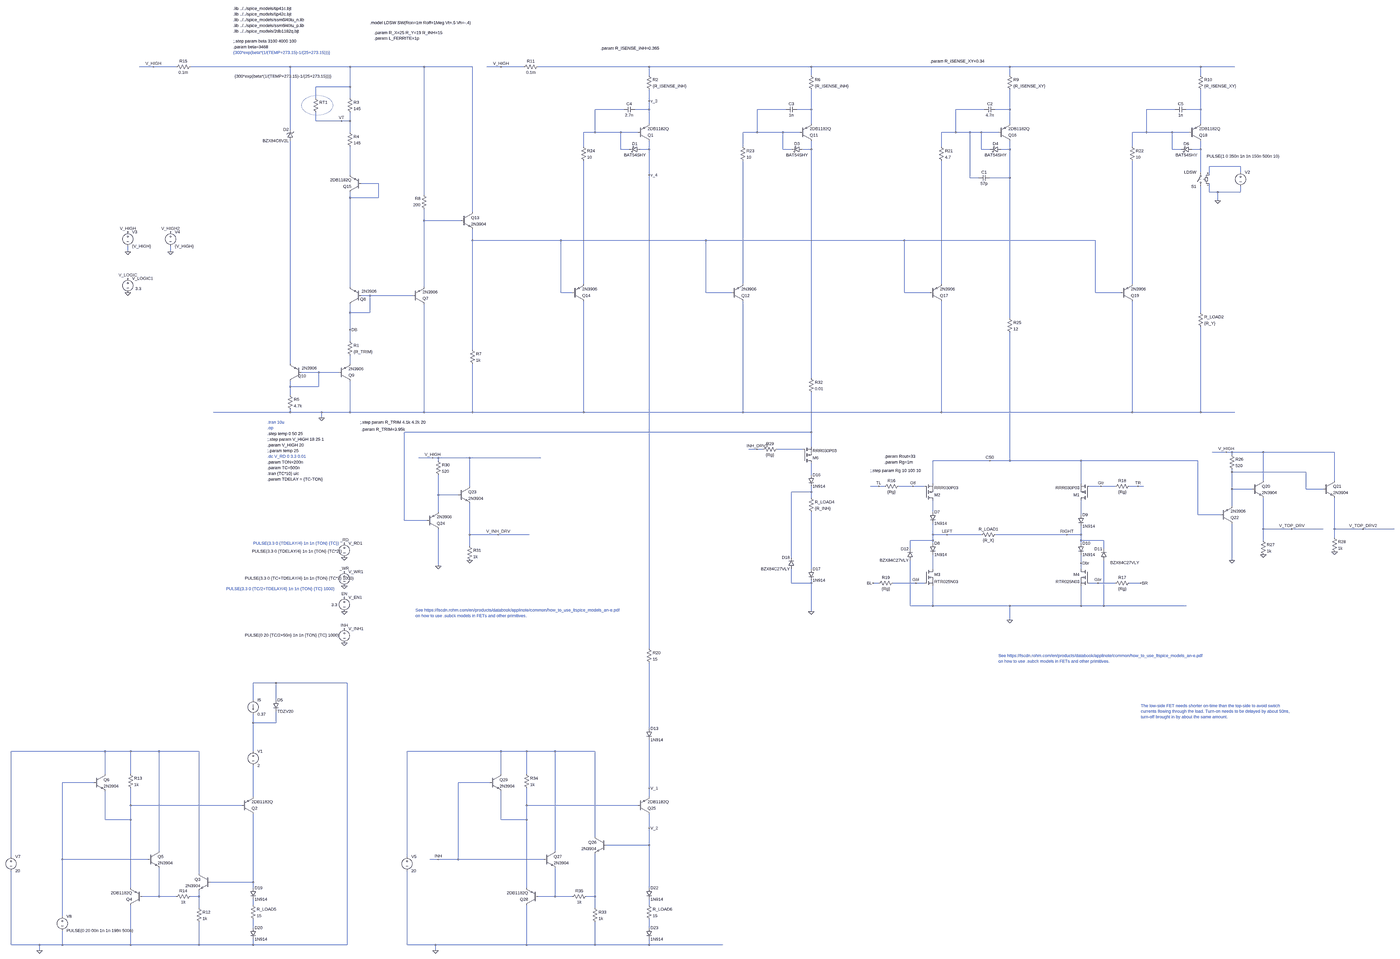
[diagram p0: schematic current_switch_test_bed_2.asc, whole sheet]
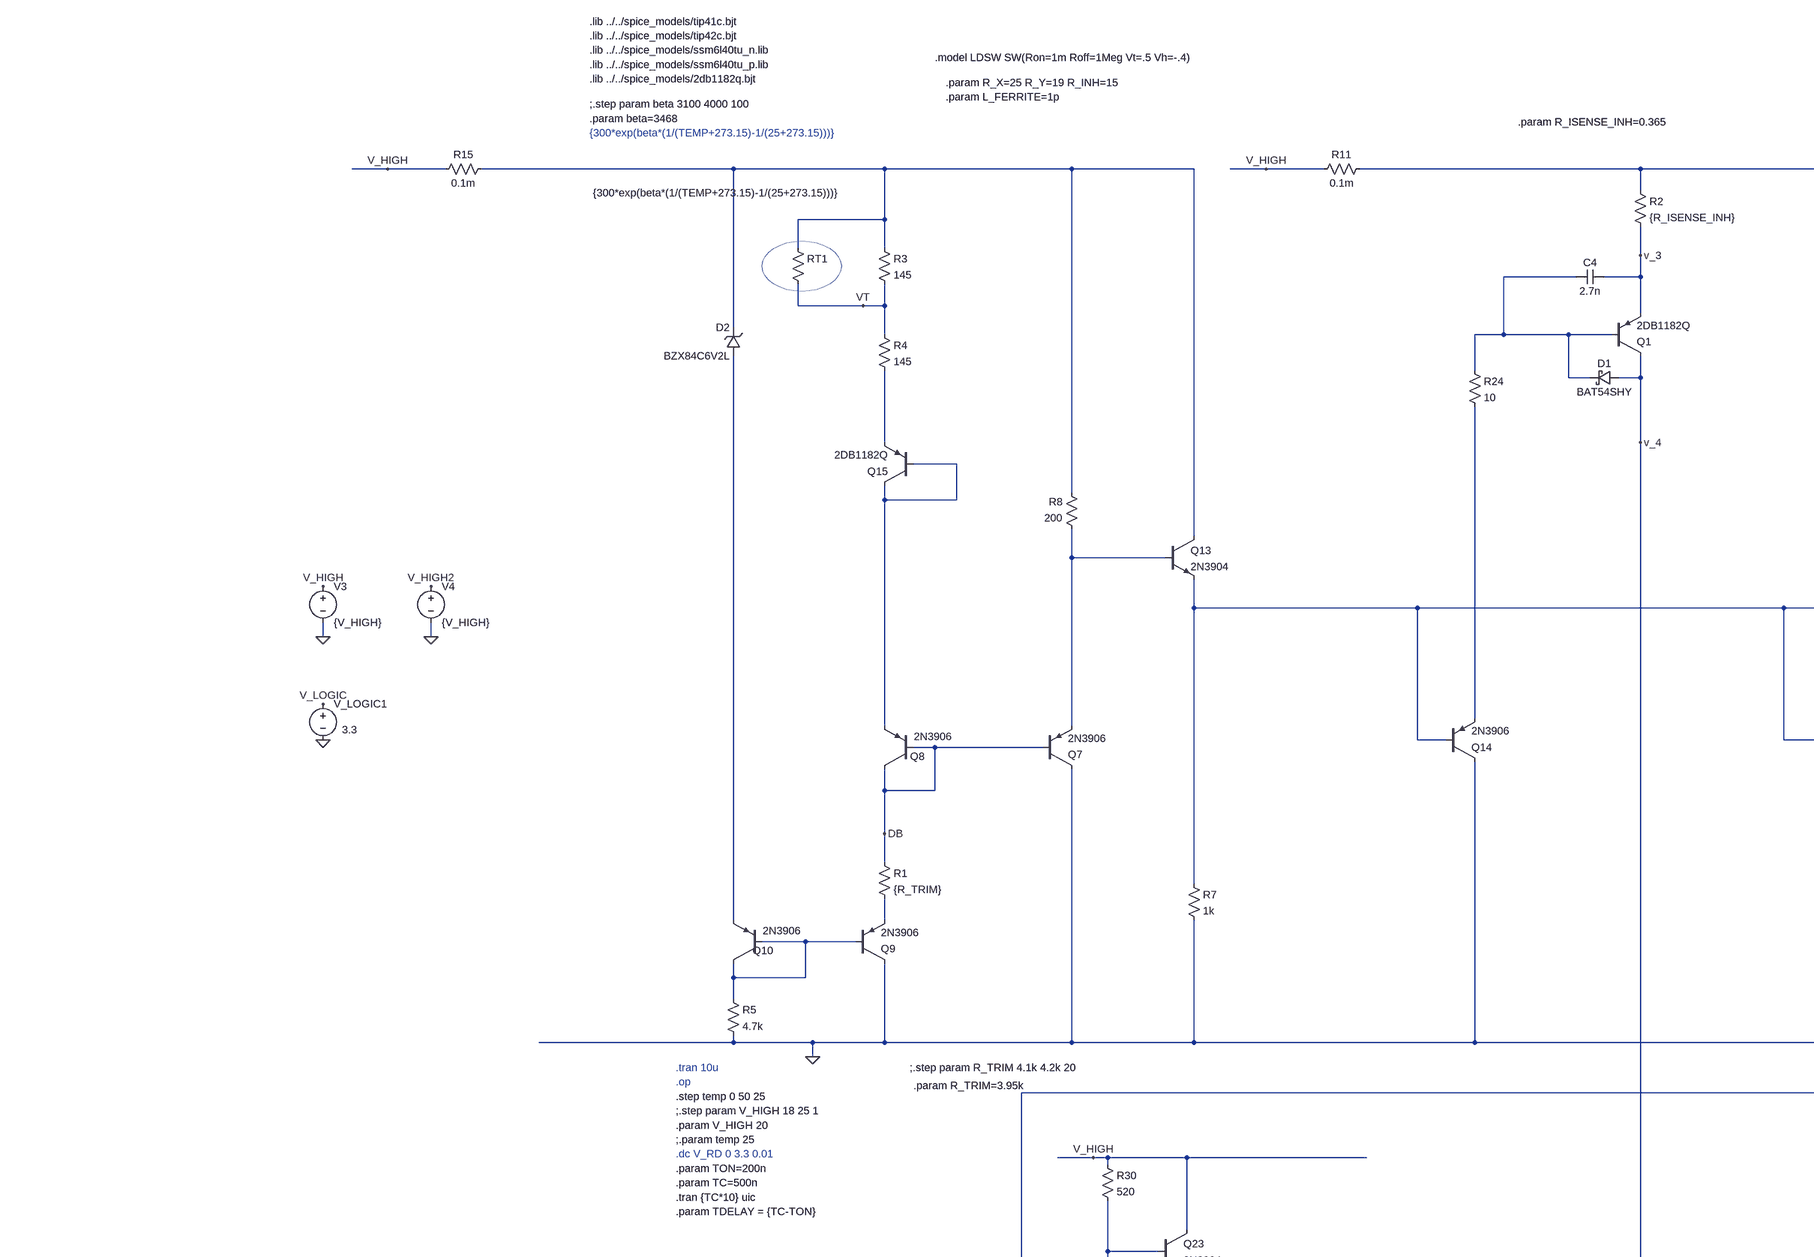
[diagram p1: schematic current_switch_test_bed_2.asc, part, row 1 of 2, column 1 of 2]
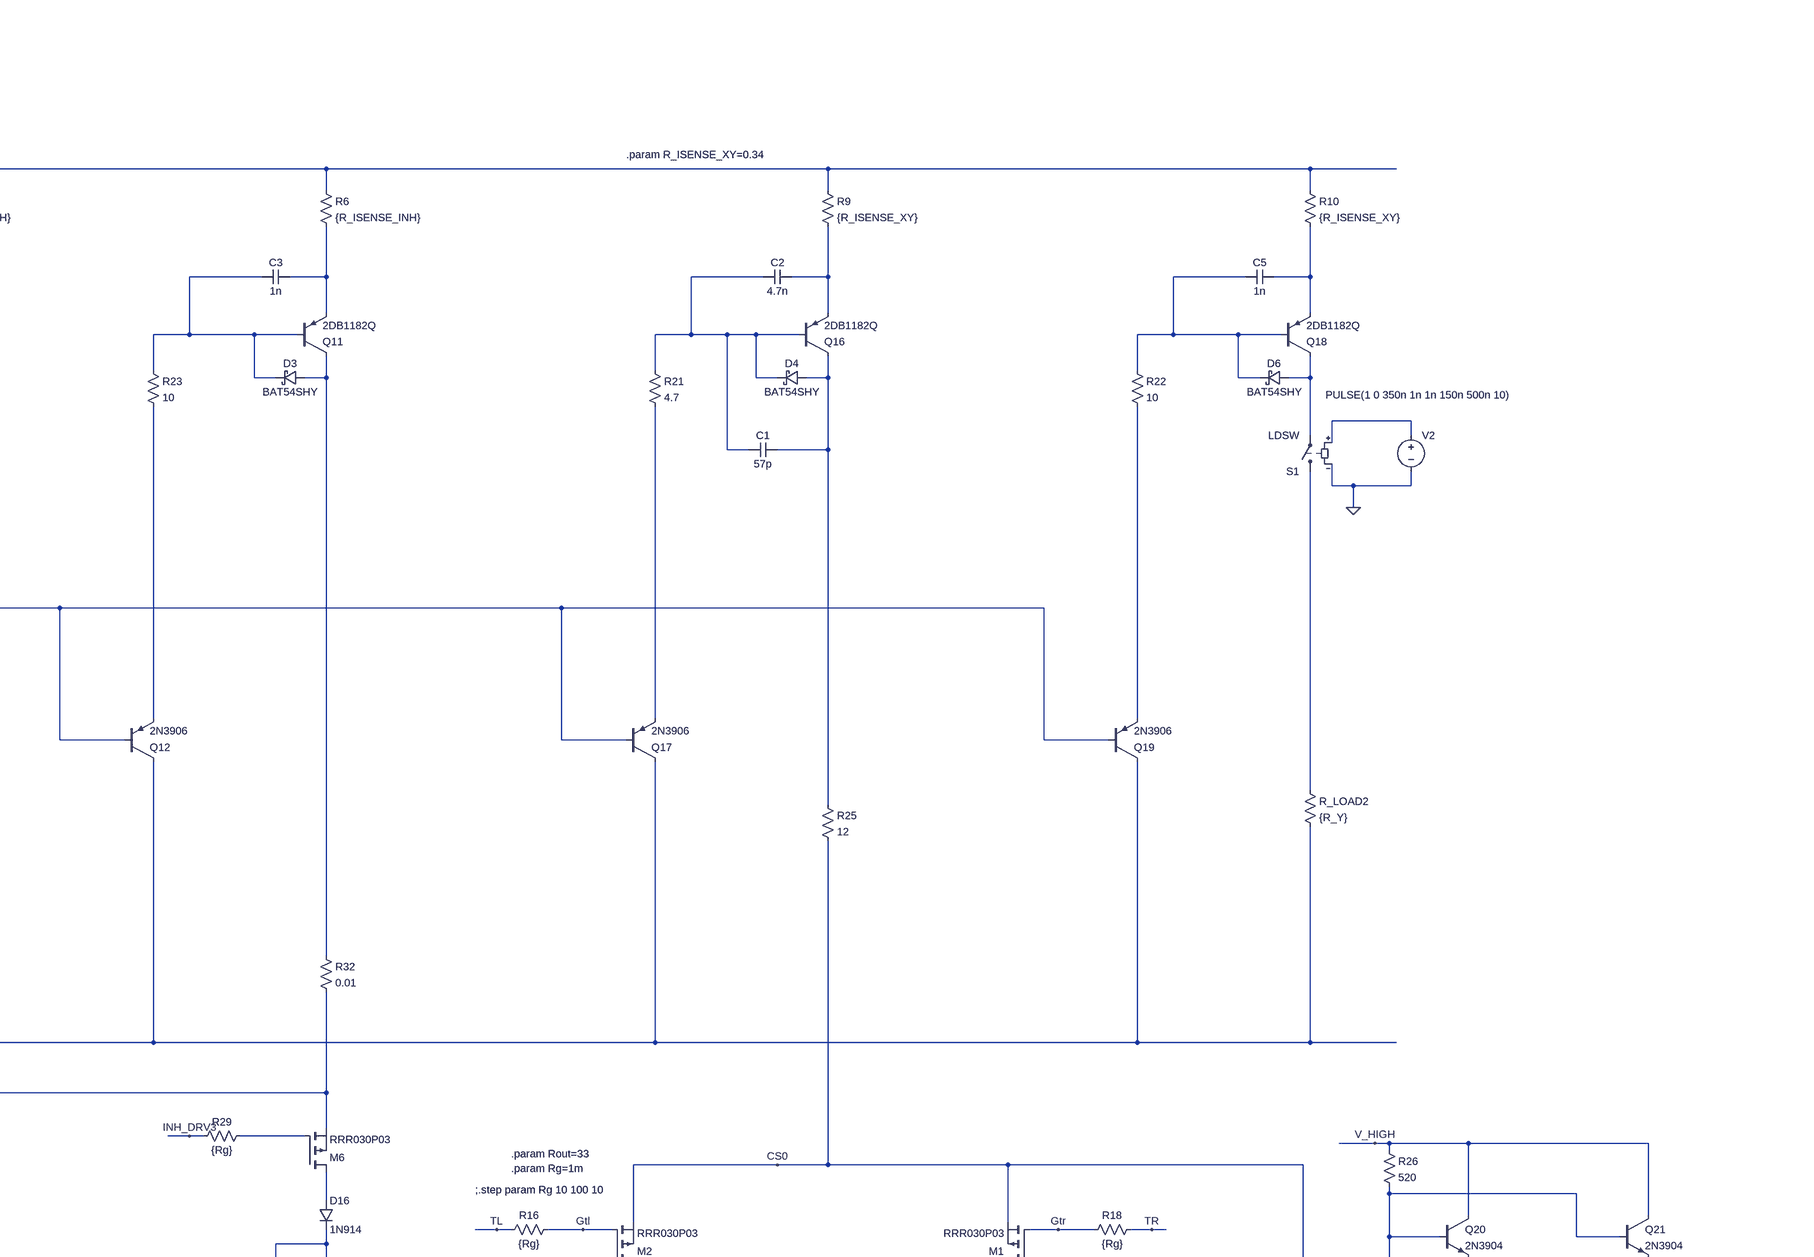
[diagram p2: schematic current_switch_test_bed_2.asc, part, row 1 of 2, column 2 of 2]
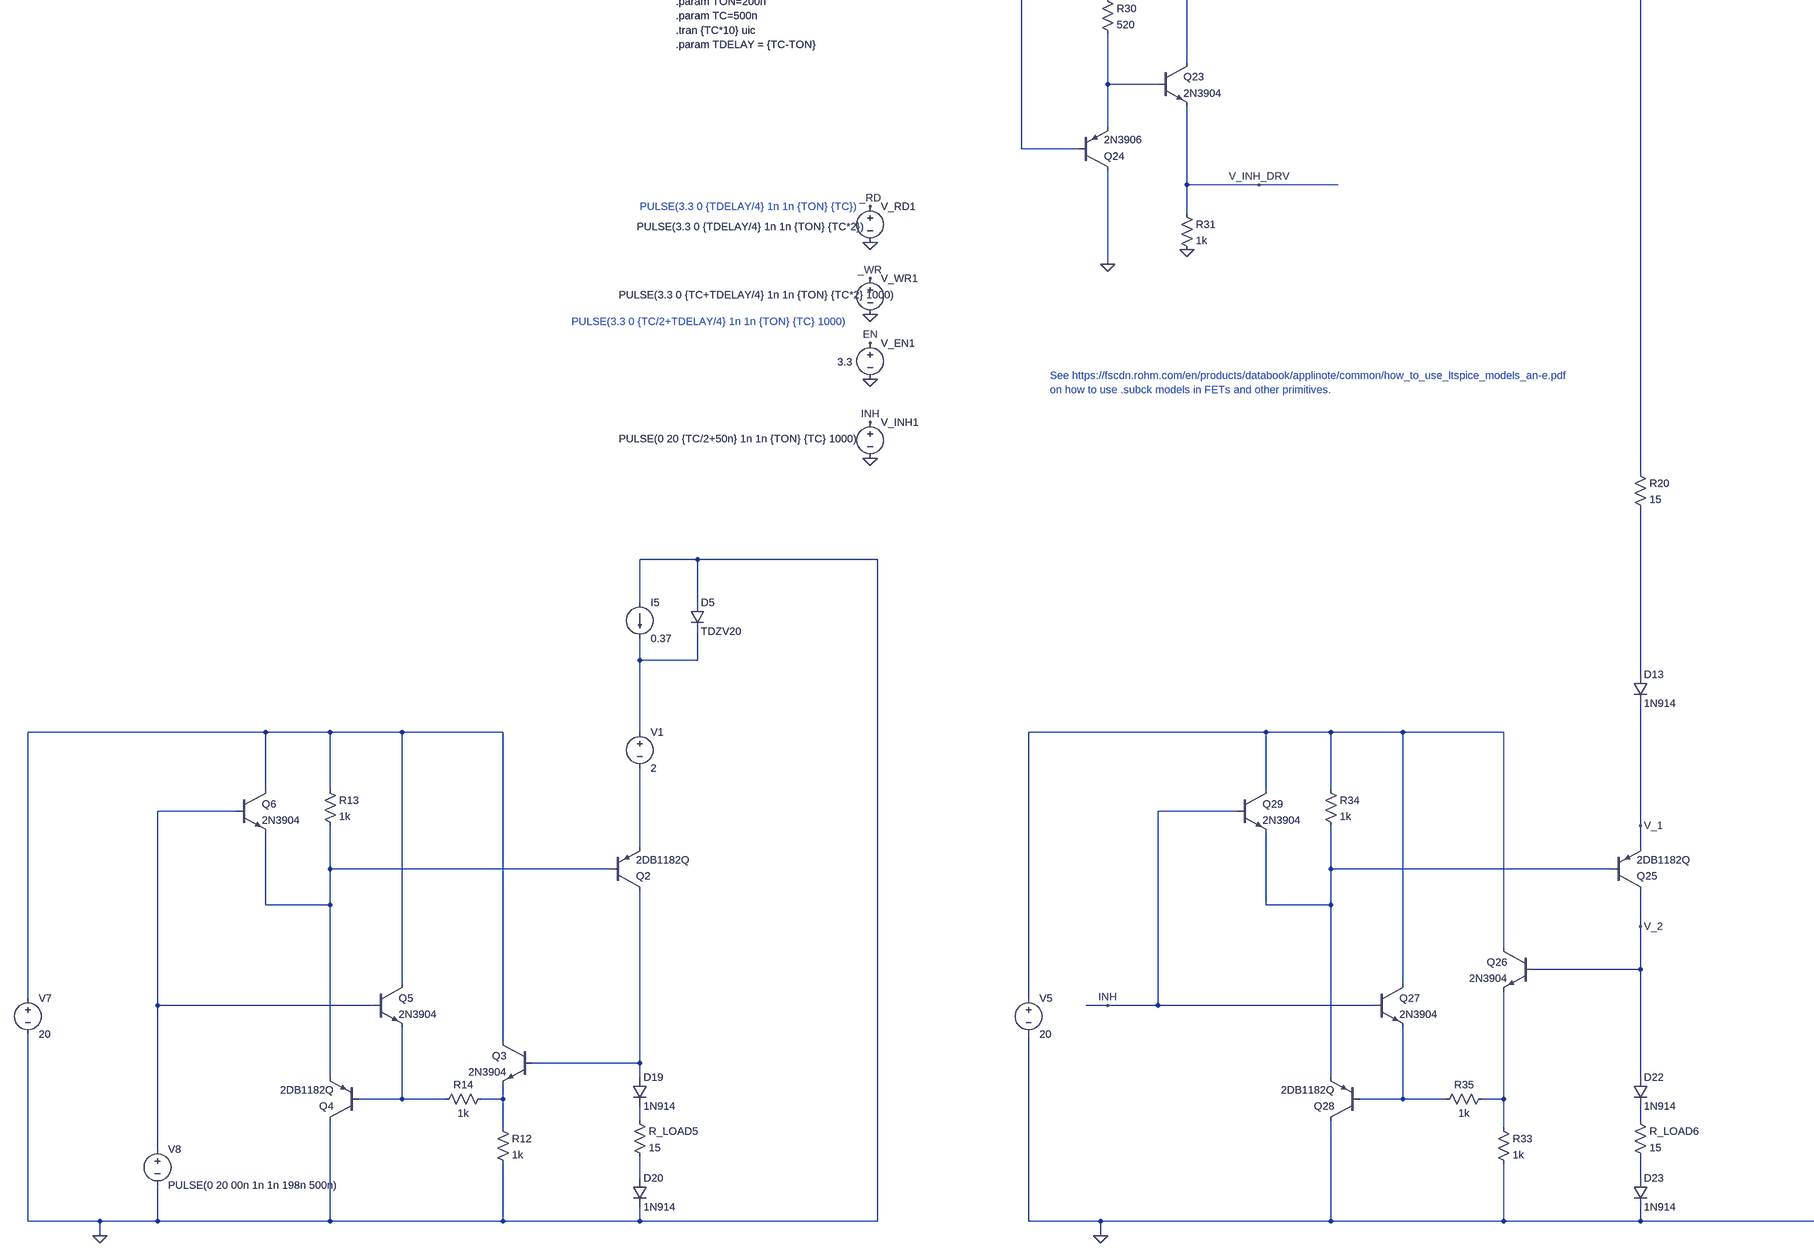
[diagram p3: schematic current_switch_test_bed_2.asc, part, row 2 of 2, column 1 of 2]
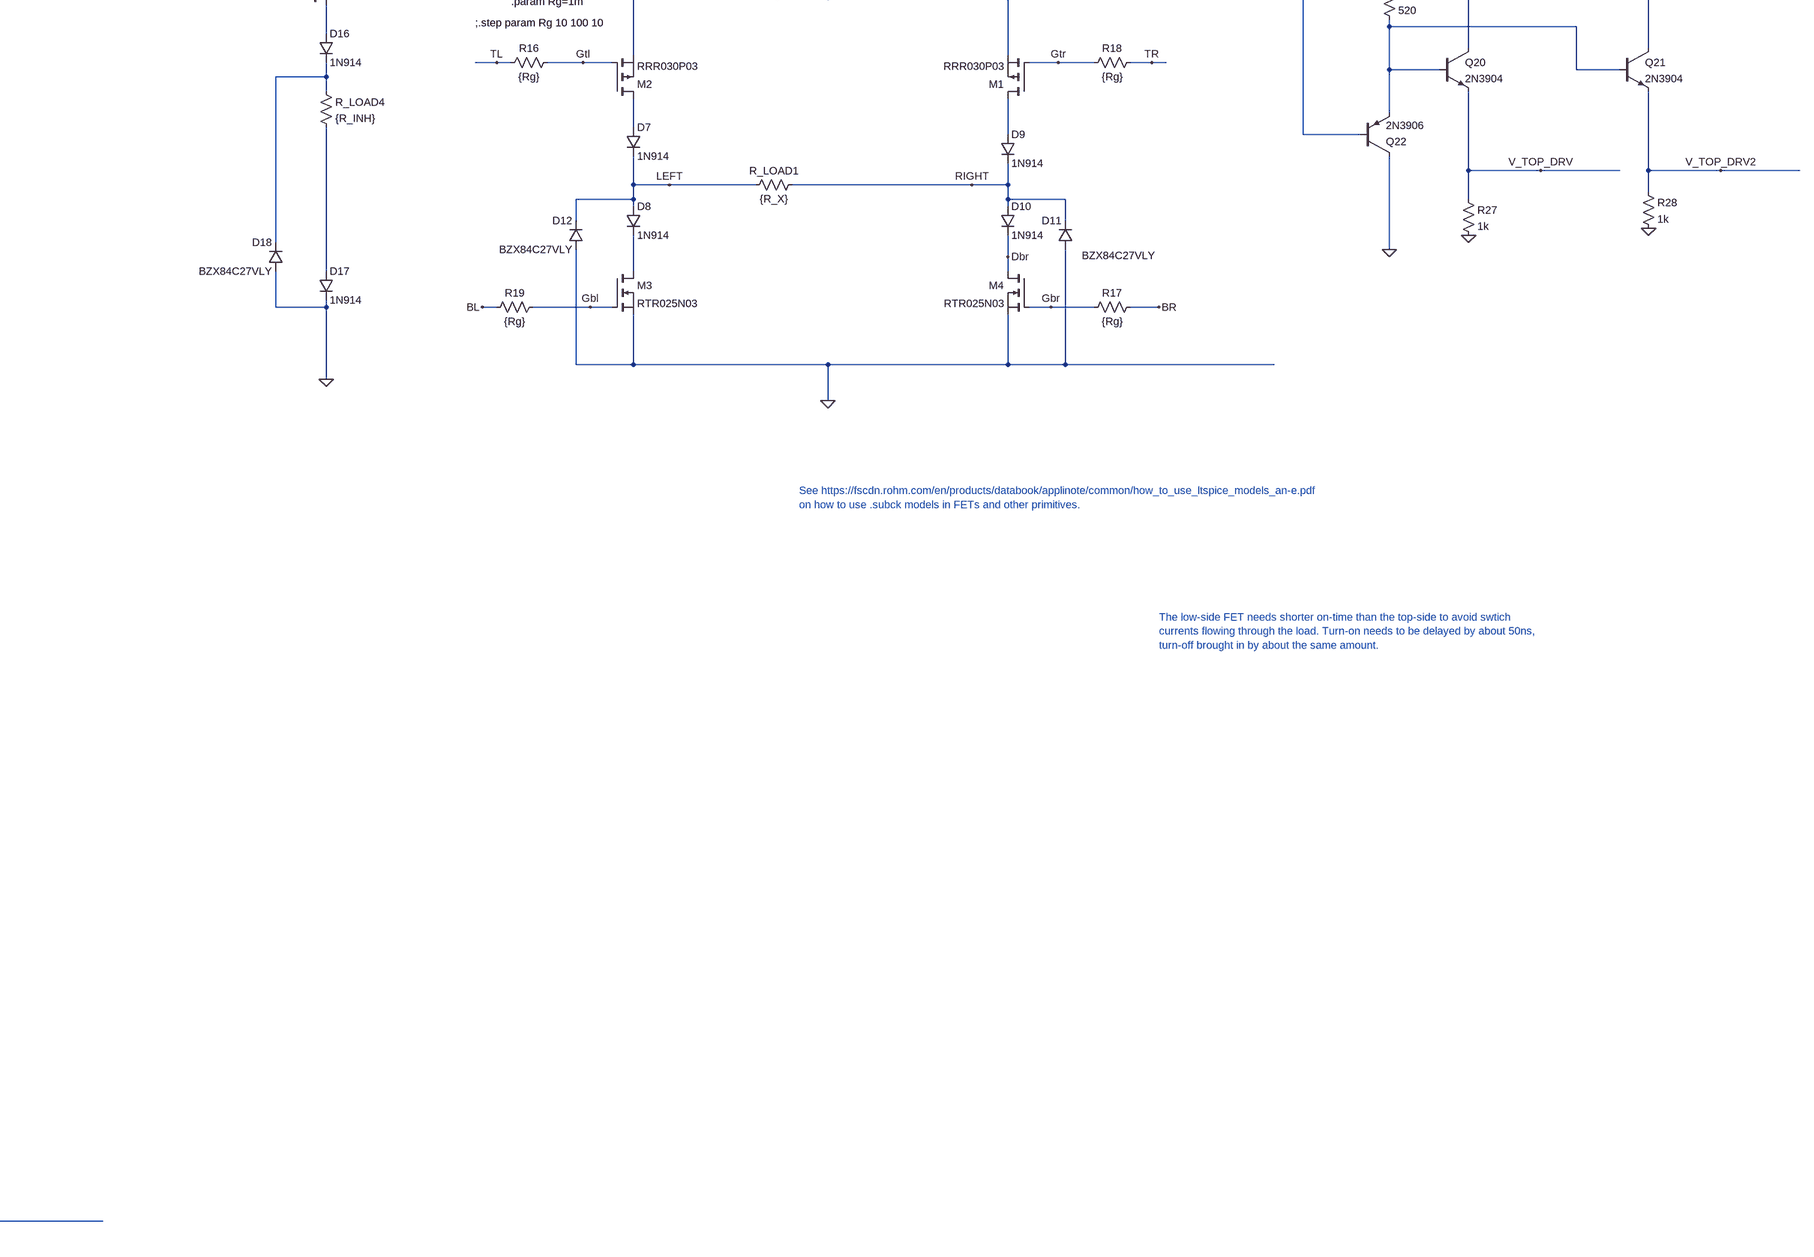
[diagram p4: schematic current_switch_test_bed_2.asc, part, row 2 of 2, column 2 of 2]
current_switch_test_bed_2.asc, the LTspice schematic file:
Version 4.1
SHEET 1 6468 2404
WIRE -624 -4320 -704 -4320
WIRE -496 -4320 -624 -4320
WIRE 144 -4320 -416 -4320
WIRE 480 -4320 144 -4320
WIRE 896 -4320 480 -4320
WIRE 1168 -4320 896 -4320
WIRE 1328 -4320 1248 -4320
WIRE 1456 -4320 1328 -4320
WIRE 2160 -4320 1536 -4320
WIRE 3184 -4320 2160 -4320
WIRE 4304 -4320 3184 -4320
WIRE 5376 -4320 4304 -4320
WIRE 5568 -4320 5376 -4320
WIRE 2160 -4272 2160 -4320
WIRE 3184 -4272 3184 -4320
WIRE 4304 -4272 4304 -4320
WIRE 5376 -4272 5376 -4320
WIRE 480 -4208 480 -4320
WIRE 480 -4208 288 -4208
WIRE 288 -4144 288 -4208
WIRE 480 -4144 480 -4208
WIRE 2160 -4128 2160 -4192
WIRE 2016 -4080 1856 -4080
WIRE 2160 -4080 2160 -4128
WIRE 2160 -4080 2080 -4080
WIRE 3040 -4080 2880 -4080
WIRE 3184 -4080 3184 -4192
WIRE 3184 -4080 3104 -4080
WIRE 4160 -4080 4000 -4080
WIRE 4304 -4080 4304 -4192
WIRE 4304 -4080 4224 -4080
WIRE 5232 -4080 5072 -4080
WIRE 5376 -4080 5376 -4192
WIRE 5376 -4080 5296 -4080
WIRE 288 -4016 288 -4064
WIRE 432 -4016 288 -4016
WIRE 480 -4016 480 -4064
WIRE 480 -4016 432 -4016
WIRE 2160 -4000 2160 -4080
WIRE 3184 -4000 3184 -4080
WIRE 4304 -4000 4304 -4080
WIRE 5376 -4000 5376 -4080
WIRE 144 -3968 144 -4320
WIRE 480 -3952 480 -4016
WIRE 1856 -3952 1856 -4080
WIRE 1856 -3952 1792 -3952
WIRE 2000 -3952 1856 -3952
WIRE 2096 -3952 2000 -3952
WIRE 2880 -3952 2880 -4080
WIRE 2880 -3952 2800 -3952
WIRE 3024 -3952 2880 -3952
WIRE 3120 -3952 3024 -3952
WIRE 4000 -3952 4000 -4080
WIRE 4000 -3952 3920 -3952
WIRE 4080 -3952 4000 -3952
WIRE 4144 -3952 4080 -3952
WIRE 4240 -3952 4144 -3952
WIRE 5072 -3952 5072 -4080
WIRE 5072 -3952 4992 -3952
WIRE 5216 -3952 5072 -3952
WIRE 5312 -3952 5216 -3952
WIRE 1792 -3872 1792 -3952
WIRE 2800 -3872 2800 -3952
WIRE 3920 -3872 3920 -3952
WIRE 4992 -3872 4992 -3952
WIRE 2000 -3856 2000 -3952
WIRE 2048 -3856 2000 -3856
WIRE 2160 -3856 2160 -3904
WIRE 2160 -3856 2112 -3856
WIRE 3024 -3856 3024 -3952
WIRE 3072 -3856 3024 -3856
WIRE 3184 -3856 3184 -3904
WIRE 3184 -3856 3136 -3856
WIRE 4144 -3856 4144 -3952
WIRE 4192 -3856 4144 -3856
WIRE 4304 -3856 4304 -3904
WIRE 4304 -3856 4256 -3856
WIRE 5216 -3856 5216 -3952
WIRE 5264 -3856 5216 -3856
WIRE 5376 -3856 5376 -3904
WIRE 5376 -3856 5328 -3856
WIRE 5600 -3760 5424 -3760
WIRE 5376 -3728 5376 -3856
WIRE 5600 -3728 5600 -3760
WIRE 480 -3712 480 -3872
WIRE 2160 -3712 2160 -3856
WIRE 5424 -3712 5424 -3760
WIRE 4080 -3696 4080 -3952
WIRE 4128 -3696 4080 -3696
WIRE 4304 -3696 4304 -3856
WIRE 4304 -3696 4192 -3696
WIRE 640 -3664 544 -3664
WIRE 5424 -3616 5424 -3664
WIRE 5472 -3616 5424 -3616
WIRE 5600 -3616 5600 -3648
WIRE 5600 -3616 5472 -3616
WIRE 896 -3600 896 -4320
WIRE 480 -3584 480 -3616
WIRE 640 -3584 640 -3664
WIRE 640 -3584 480 -3584
WIRE 5472 -3568 5472 -3616
WIRE 1168 -3504 1168 -4320
WIRE 896 -3456 896 -3520
WIRE 1104 -3456 896 -3456
WIRE 1168 -3344 1168 -3408
WIRE 1664 -3344 1168 -3344
WIRE 2592 -3344 1664 -3344
WIRE 3712 -3344 2592 -3344
WIRE 4784 -3344 3712 -3344
WIRE -768 -3280 -768 -3312
WIRE -528 -3280 -528 -3312
WIRE 1792 -3072 1792 -3792
WIRE 2800 -3072 2800 -3792
WIRE 3920 -3072 3920 -3792
WIRE 4992 -3072 4992 -3792
WIRE 480 -3056 480 -3584
WIRE 896 -3056 896 -3456
WIRE 1664 -3024 1664 -3344
WIRE 1728 -3024 1664 -3024
WIRE 2592 -3024 2592 -3344
WIRE 2736 -3024 2592 -3024
WIRE 3712 -3024 3712 -3344
WIRE 3856 -3024 3712 -3024
WIRE 4784 -3024 4784 -3344
WIRE 4928 -3024 4784 -3024
WIRE 592 -3008 544 -3008
WIRE 832 -3008 592 -3008
WIRE 480 -2912 480 -2960
WIRE 592 -2912 592 -3008
WIRE 592 -2912 480 -2912
WIRE 5376 -2912 5376 -3648
WIRE 4304 -2880 4304 -3696
WIRE 480 -2816 480 -2912
WIRE 480 -2752 480 -2816
WIRE 1168 -2704 1168 -3344
WIRE 144 -2624 144 -3904
WIRE 480 -2624 480 -2672
WIRE 304 -2576 208 -2576
WIRE 416 -2576 304 -2576
WIRE 3184 -2544 3184 -3856
WIRE 144 -2496 144 -2528
WIRE 304 -2496 304 -2576
WIRE 304 -2496 144 -2496
WIRE 144 -2448 144 -2496
WIRE 144 -2352 144 -2368
WIRE 144 -2352 -288 -2352
WIRE 320 -2352 144 -2352
WIRE 480 -2352 480 -2528
WIRE 480 -2352 320 -2352
WIRE 896 -2352 896 -2960
WIRE 896 -2352 480 -2352
WIRE 1168 -2352 1168 -2624
WIRE 1168 -2352 896 -2352
WIRE 1792 -2352 1792 -2976
WIRE 1792 -2352 1168 -2352
WIRE 2800 -2352 2800 -2976
WIRE 2800 -2352 1792 -2352
WIRE 3920 -2352 3920 -2976
WIRE 3920 -2352 2800 -2352
WIRE 4992 -2352 4992 -2976
WIRE 4992 -2352 3920 -2352
WIRE 5376 -2352 5376 -2832
WIRE 5376 -2352 4992 -2352
WIRE 5568 -2352 5376 -2352
WIRE 320 -2320 320 -2352
WIRE 3184 -2240 3184 -2464
WIRE 3184 -2240 784 -2240
WIRE 3184 -2160 3184 -2240
WIRE 2880 -2144 2832 -2144
WIRE 2912 -2144 2880 -2144
WIRE 3136 -2144 2992 -2144
WIRE 5520 -2128 5440 -2128
WIRE 5552 -2128 5520 -2128
WIRE 5728 -2128 5552 -2128
WIRE 6128 -2128 5728 -2128
WIRE 5552 -2112 5552 -2128
WIRE 944 -2096 864 -2096
WIRE 976 -2096 944 -2096
WIRE 1152 -2096 976 -2096
WIRE 1552 -2096 1152 -2096
WIRE 976 -2080 976 -2096
WIRE 4192 -2080 3872 -2080
WIRE 4304 -2080 4304 -2800
WIRE 4304 -2080 4192 -2080
WIRE 4704 -2080 4304 -2080
WIRE 5360 -2080 4704 -2080
WIRE 5552 -2016 5552 -2032
WIRE 5968 -2016 5552 -2016
WIRE 3184 -2000 3184 -2064
WIRE 5728 -1968 5728 -2128
WIRE 6128 -1968 6128 -2128
WIRE 3872 -1952 3872 -2080
WIRE 4704 -1952 4704 -2080
WIRE 1152 -1936 1152 -2096
WIRE 3568 -1936 3520 -1936
WIRE 3600 -1936 3568 -1936
WIRE 3760 -1936 3680 -1936
WIRE 3824 -1936 3760 -1936
WIRE 4816 -1936 4752 -1936
WIRE 4896 -1936 4816 -1936
WIRE 5024 -1936 4976 -1936
WIRE 5056 -1936 5024 -1936
WIRE 5552 -1920 5552 -2016
WIRE 5664 -1920 5552 -1920
WIRE 5968 -1920 5968 -2016
WIRE 6064 -1920 5968 -1920
WIRE 3184 -1904 3184 -1936
WIRE 3184 -1904 3072 -1904
WIRE 976 -1888 976 -2000
WIRE 1088 -1888 976 -1888
WIRE 3184 -1872 3184 -1904
WIRE 5552 -1824 5552 -1920
WIRE 976 -1792 976 -1888
WIRE 3872 -1792 3872 -1856
WIRE 4704 -1776 4704 -1856
WIRE 5360 -1776 5360 -2080
WIRE 5488 -1776 5360 -1776
WIRE 784 -1744 784 -2240
WIRE 912 -1744 784 -1744
WIRE 5728 -1696 5728 -1872
WIRE 5888 -1696 5728 -1696
WIRE 6064 -1696 5888 -1696
WIRE 6128 -1696 6128 -1872
WIRE 6288 -1696 6128 -1696
WIRE 6464 -1696 6288 -1696
WIRE 1152 -1664 1152 -1840
WIRE 1312 -1664 1152 -1664
WIRE 1488 -1664 1312 -1664
WIRE 3872 -1664 3872 -1728
WIRE 3952 -1664 3872 -1664
WIRE 4144 -1664 3952 -1664
WIRE 4624 -1664 4224 -1664
WIRE 4704 -1664 4704 -1712
WIRE 4704 -1664 4624 -1664
WIRE 6128 -1648 6128 -1696
WIRE 3872 -1632 3872 -1664
WIRE 3872 -1632 3744 -1632
WIRE 4704 -1632 4704 -1664
WIRE 4832 -1632 4704 -1632
WIRE 5728 -1632 5728 -1696
WIRE 3872 -1616 3872 -1632
WIRE 4704 -1616 4704 -1632
WIRE 1152 -1600 1152 -1664
WIRE 3744 -1584 3744 -1632
WIRE 4832 -1584 4832 -1632
WIRE 3072 -1536 3072 -1904
WIRE 5552 -1520 5552 -1728
WIRE 4704 -1504 4704 -1552
WIRE 976 -1488 976 -1696
WIRE 3184 -1472 3184 -1792
WIRE 3872 -1472 3872 -1552
WIRE 4704 -1472 4704 -1504
WIRE 3072 -1392 3072 -1472
WIRE 3184 -1392 3184 -1408
WIRE 3184 -1392 3072 -1392
WIRE 3568 -1392 3536 -1392
WIRE 3776 -1392 3648 -1392
WIRE 3824 -1392 3776 -1392
WIRE 4800 -1392 4752 -1392
WIRE 4896 -1392 4800 -1392
WIRE 5040 -1392 4976 -1392
WIRE 3744 -1264 3744 -1520
WIRE 3872 -1264 3872 -1376
WIRE 3872 -1264 3744 -1264
WIRE 4304 -1264 3872 -1264
WIRE 4704 -1264 4704 -1376
WIRE 4704 -1264 4304 -1264
WIRE 4832 -1264 4832 -1520
WIRE 4832 -1264 4704 -1264
WIRE 5296 -1264 4832 -1264
WIRE 3184 -1232 3184 -1392
WIRE 4304 -1184 4304 -1264
WIRE 2160 -1024 2160 -3712
WIRE 64 -816 -64 -816
WIRE 464 -816 64 -816
WIRE -64 -720 -64 -816
WIRE 64 -720 64 -816
WIRE -64 -592 -64 -640
WIRE 64 -592 64 -656
WIRE 64 -592 -64 -592
WIRE 2160 -560 2160 -944
WIRE -896 -432 -1424 -432
WIRE -752 -432 -896 -432
WIRE -592 -432 -752 -432
WIRE -368 -432 -592 -432
WIRE -64 -432 -64 -592
WIRE 1328 -432 800 -432
WIRE 1472 -432 1328 -432
WIRE 1632 -432 1472 -432
WIRE 1856 -432 1632 -432
WIRE -896 -304 -896 -432
WIRE -752 -304 -752 -432
WIRE 1328 -304 1328 -432
WIRE 1472 -304 1472 -432
WIRE -960 -256 -1136 -256
WIRE 1264 -256 1088 -256
WIRE 2160 -224 2160 -496
WIRE -64 -176 -64 -352
WIRE 2160 -176 2160 -224
WIRE -752 -128 -752 -224
WIRE -128 -128 -752 -128
WIRE 1472 -128 1472 -224
WIRE 2096 -128 1472 -128
WIRE -896 -48 -896 -208
WIRE -752 -48 -752 -128
WIRE -752 -48 -896 -48
WIRE 1328 -48 1328 -208
WIRE 1472 -48 1472 -128
WIRE 1472 -48 1328 -48
WIRE 2160 0 2160 -80
WIRE 1856 48 1856 -432
WIRE 2160 96 2160 0
WIRE 2160 96 1920 96
WIRE -592 128 -592 -432
WIRE 1632 128 1632 -432
WIRE -1424 160 -1424 -432
WIRE 800 160 800 -432
WIRE -1136 176 -1136 -256
WIRE -656 176 -1136 176
WIRE 976 176 928 176
WIRE 1088 176 1088 -256
WIRE 1088 176 976 176
WIRE 1568 176 1088 176
WIRE -368 256 -368 -432
WIRE -64 304 -64 -80
WIRE -64 304 -304 304
WIRE -752 336 -752 -48
WIRE -64 336 -64 304
WIRE 1472 336 1472 -48
WIRE 2160 336 2160 96
WIRE -592 384 -592 224
WIRE -592 384 -688 384
WIRE -496 384 -592 384
WIRE -368 384 -368 352
WIRE -368 384 -416 384
WIRE 1632 384 1632 224
WIRE 1632 384 1536 384
WIRE 1728 384 1632 384
WIRE 1856 384 1856 144
WIRE 1856 384 1808 384
WIRE -64 432 -64 400
WIRE 2160 432 2160 400
WIRE -368 448 -368 384
WIRE 1856 448 1856 384
WIRE -1136 496 -1136 176
WIRE -64 560 -64 512
WIRE 2160 560 2160 512
WIRE -1424 656 -1424 240
WIRE -1264 656 -1424 656
WIRE -1136 656 -1136 576
WIRE -1136 656 -1264 656
WIRE -752 656 -752 432
WIRE -752 656 -1136 656
WIRE -368 656 -368 528
WIRE -368 656 -752 656
WIRE -64 656 -64 624
WIRE -64 656 -368 656
WIRE 464 656 464 -816
WIRE 464 656 -64 656
WIRE 800 656 800 240
WIRE 960 656 800 656
WIRE 1472 656 1472 432
WIRE 1472 656 960 656
WIRE 1856 656 1856 528
WIRE 1856 656 1472 656
WIRE 2160 656 2160 624
WIRE 2160 656 1856 656
WIRE 2688 656 2160 656
WIRE -1264 688 -1264 656
WIRE 960 688 960 656
FLAG -1264 688 0
FLAG 320 -2320 0
FLAG 432 -4016 VT
FLAG 480 -2816 DB
FLAG 5472 -3568 0
FLAG 1328 -4320 V_HIGH
FLAG -624 -4320 V_HIGH
FLAG -768 -3280 0
FLAG -768 -3392 V_HIGH
FLAG 4304 -1184 0
FLAG 3568 -1936 TL
FLAG 3952 -1664 LEFT
FLAG 4624 -1664 RIGHT
FLAG 448 -1616 _RD
FLAG 448 -1536 0
FLAG 448 -1312 EN
FLAG 448 -1232 0
FLAG -768 -3104 V_LOGIC
FLAG -768 -3024 0
FLAG 3760 -1936 Gtl
FLAG 4192 -2080 CS0
FLAG 4800 -1392 Gbr
FLAG 4704 -1504 Dbr
FLAG 3776 -1392 Gbl
FLAG 4816 -1936 Gtr
FLAG 5024 -1936 TR
FLAG 5040 -1392 BR
FLAG 448 -1136 INH
FLAG 448 -1056 0
FLAG -528 -3280 0
FLAG -528 -3392 V_HIGH2
FLAG 3536 -1392 BL
FLAG 448 -1456 _WR
FLAG 448 -1376 0
FLAG 5520 -2128 V_HIGH
FLAG 5888 -1696 V_TOP_DRV
FLAG 6288 -1696 V_TOP_DRV2
FLAG 5552 -1520 0
FLAG 5728 -1552 0
FLAG 6128 -1568 0
FLAG 3184 -1232 0
FLAG 2880 -2144 INH_DRV3
FLAG 944 -2096 V_HIGH
FLAG 1312 -1664 V_INH_DRV
FLAG 976 -1488 0
FLAG 1152 -1520 0
FLAG 960 688 0
FLAG 976 176 INH
FLAG 2160 -224 V_1
FLAG 2160 0 V_2
FLAG 2160 -4128 v_3
FLAG 2160 -3712 v_4
SYMBOL pnp -128 -80 M180
SYMATTR InstName Q2
SYMATTR Value 2DB1182Q
SYMBOL res -80 416 R0
SYMATTR InstName R_LOAD5
SYMATTR Value 15
SYMBOL diode 48 -720 R0
SYMATTR InstName D5
SYMATTR Value TDZV20
SYMBOL current -64 -720 R0
WINDOW 123 0 0 Left 0
WINDOW 39 0 0 Left 0
SYMATTR InstName I5
SYMATTR Value 0.37
SYMBOL npn -304 256 M0
SYMATTR InstName Q3
SYMATTR Value 2N3904
SYMBOL voltage -1424 144 R0
SYMATTR InstName V7
SYMATTR Value 20
SYMBOL res -384 432 R0
SYMATTR InstName R12
SYMATTR Value 1k
SYMBOL res -768 -320 R0
SYMATTR InstName R13
SYMATTR Value 1k
SYMBOL res -400 368 R90
WINDOW 0 0 56 VBottom 2
WINDOW 3 32 56 VTop 2
SYMATTR InstName R14
SYMATTR Value 1k
SYMBOL voltage -1136 480 R0
WINDOW 123 0 0 Left 0
WINDOW 39 0 0 Left 0
SYMATTR InstName V8
SYMATTR Value PULSE(0 20 00n 1n 1n 198n 500n)
SYMBOL npn -656 128 R0
SYMATTR InstName Q5
SYMATTR Value 2N3904
SYMBOL pnp -688 432 R180
SYMATTR InstName Q4
SYMATTR Value 2DB1182Q
SYMBOL npn -960 -304 R0
SYMATTR InstName Q6
SYMATTR Value 2N3904
SYMBOL voltage -64 -448 R0
SYMATTR InstName V1
SYMATTR Value 2
SYMBOL res 464 -2768 R0
SYMATTR InstName R1
SYMATTR Value {R_TRIM}
SYMBOL res 2144 -4288 R0
SYMATTR InstName R2
SYMATTR Value {R_ISENSE_INH}
SYMBOL pnp 2096 -3904 M180
SYMATTR InstName Q1
SYMATTR Value 2DB1182Q
SYMBOL pnp 832 -2960 M180
SYMATTR InstName Q7
SYMATTR Value 2N3906
SYMBOL pnp 544 -2960 R180
WINDOW 0 -25 28 Left 2
WINDOW 3 -86 72 Left 2
SYMATTR InstName Q8
SYMATTR Value 2N3906
SYMBOL res 464 -4160 R0
SYMATTR InstName R3
SYMATTR Value 145
SYMBOL res 464 -3968 R0
SYMATTR InstName R4
SYMATTR Value 145
SYMBOL res 272 -4160 R0
WINDOW 3 -440 -107 Left 2
SYMATTR Value {300*exp(beta*(1/(TEMP+273.15)-1/(25+273.15)))}
SYMATTR InstName RT1
SYMBOL schottky 2112 -3872 R90
WINDOW 0 0 32 VBottom 2
WINDOW 3 32 32 VTop 2
SYMATTR InstName D1
SYMATTR Value BAT54SHY
SYMATTR Description Diode
SYMATTR Type diode
SYMBOL zener 160 -3904 R180
WINDOW 0 24 64 Left 2
WINDOW 3 24 0 Left 2
SYMATTR InstName D2
SYMATTR Value BZX84C6V2L
SYMBOL res 128 -2464 R0
SYMATTR InstName R5
SYMATTR Value 4.7k
SYMBOL pnp 416 -2528 M180
SYMATTR InstName Q9
SYMATTR Value 2N3906
SYMBOL pnp 208 -2528 R180
WINDOW 0 -25 28 Left 2
WINDOW 3 -86 72 Left 2
SYMATTR InstName Q10
SYMATTR Value 2N3906
SYMBOL res 3168 -4288 R0
SYMATTR InstName R6
SYMATTR Value {R_ISENSE_INH}
SYMBOL pnp 3120 -3904 M180
SYMATTR InstName Q11
SYMATTR Value 2DB1182Q
SYMBOL pnp 2736 -2976 M180
SYMATTR InstName Q12
SYMATTR Value 2N3906
SYMBOL schottky 3136 -3872 R90
WINDOW 0 0 32 VBottom 2
WINDOW 3 32 32 VTop 2
SYMATTR InstName D3
SYMATTR Value BAT54SHY
SYMATTR Description Diode
SYMATTR Type diode
SYMBOL npn 1104 -3504 R0
SYMATTR InstName Q13
SYMATTR Value 2N3904
SYMBOL pnp 1728 -2976 M180
SYMATTR InstName Q14
SYMATTR Value 2N3906
SYMBOL res 1152 -2720 R0
SYMATTR InstName R7
SYMATTR Value 1k
SYMBOL pnp 544 -3616 R180
SYMATTR InstName Q15
SYMATTR Value 2DB1182Q
SYMBOL res 912 -3504 R180
WINDOW 0 36 76 Left 2
WINDOW 3 36 40 Left 2
SYMATTR InstName R8
SYMATTR Value 200
SYMBOL res 4288 -4288 R0
SYMATTR InstName R9
SYMATTR Value {R_ISENSE_XY}
SYMBOL pnp 4240 -3904 M180
SYMATTR InstName Q16
SYMATTR Value 2DB1182Q
SYMBOL pnp 3856 -2976 M180
SYMATTR InstName Q17
SYMATTR Value 2N3906
SYMBOL schottky 4256 -3872 R90
WINDOW 0 0 32 VBottom 2
WINDOW 3 32 32 VTop 2
SYMATTR InstName D4
SYMATTR Value BAT54SHY
SYMATTR Description Diode
SYMATTR Type diode
SYMBOL res 4128 -1648 R270
WINDOW 0 32 56 VTop 2
WINDOW 3 0 56 VBottom 2
SYMATTR InstName R_LOAD1
SYMATTR Value {R_X}
SYMBOL res 5360 -4288 R0
SYMATTR InstName R10
SYMATTR Value {R_ISENSE_XY}
SYMBOL pnp 5312 -3904 M180
SYMATTR InstName Q18
SYMATTR Value 2DB1182Q
SYMBOL pnp 4928 -2976 M180
SYMATTR InstName Q19
SYMATTR Value 2N3906
SYMBOL schottky 5328 -3872 R90
WINDOW 0 0 32 VBottom 2
WINDOW 3 32 32 VTop 2
SYMATTR InstName D6
SYMATTR Value BAT54SHY
SYMATTR Description Diode
SYMATTR Type diode
SYMBOL sw 5376 -3632 R180
SYMATTR InstName S1
SYMATTR Value LDSW
SYMBOL voltage 5600 -3744 R0
WINDOW 123 0 0 Left 0
WINDOW 39 0 0 Left 0
WINDOW 3 -190 -74 Left 2
SYMATTR Value PULSE(1 0 350n 1n 1n 150n 500n 10)
SYMATTR InstName V2
SYMBOL res 5360 -2928 R0
SYMATTR InstName R_LOAD2
SYMATTR Value {R_Y}
SYMBOL res 1440 -4304 R270
WINDOW 0 32 56 VTop 2
WINDOW 3 0 56 VBottom 2
SYMATTR InstName R11
SYMATTR Value 0.1m
SYMBOL res -512 -4304 R270
WINDOW 0 32 56 VTop 2
WINDOW 3 0 56 VBottom 2
SYMATTR InstName R15
SYMATTR Value 0.1m
SYMBOL voltage -768 -3408 R0
SYMATTR InstName V3
SYMATTR Value {V_HIGH}
SYMBOL diode 3856 -1792 R0
SYMATTR InstName D7
SYMATTR Value 1N914
SYMBOL diode 3856 -1616 R0
SYMATTR InstName D8
SYMATTR Value 1N914
SYMBOL diode 4688 -1776 R0
SYMATTR InstName D9
SYMATTR Value 1N914
SYMBOL diode 4688 -1616 R0
SYMATTR InstName D10
SYMATTR Value 1N914
SYMBOL diode 4848 -1520 R180
WINDOW 0 24 64 Left 2
WINDOW 3 -183 -13 Left 2
SYMATTR InstName D11
SYMATTR Value BZX84C27VLY
SYMBOL diode 3760 -1520 R180
WINDOW 0 24 64 Left 2
WINDOW 3 24 0 Left 2
SYMATTR InstName D12
SYMATTR Value BZX84C27VLY
SYMBOL voltage 448 -1632 R0
WINDOW 123 0 0 Left 0
WINDOW 39 0 0 Left 0
WINDOW 3 -519 61 Left 2
SYMATTR Value PULSE(3.3 0 {TDELAY/4} 1n 1n {TON} {TC*2})
SYMATTR InstName V_RD1
SYMBOL voltage 448 -1328 R0
WINDOW 123 0 0 Left 0
WINDOW 39 0 0 Left 0
WINDOW 3 -73 58 Left 2
SYMATTR Value 3.3
SYMATTR InstName V_EN1
SYMBOL voltage -768 -3120 R0
WINDOW 123 0 0 Left 0
WINDOW 39 0 0 Left 0
WINDOW 3 42 73 Left 2
SYMATTR Value 3.3
SYMATTR InstName V_LOGIC1
SYMBOL res 3696 -1952 R90
WINDOW 0 0 56 VBottom 2
WINDOW 3 32 56 VTop 2
SYMATTR InstName R16
SYMATTR Value {Rg}
SYMBOL res 4992 -1408 R90
WINDOW 0 0 56 VBottom 2
WINDOW 3 32 56 VTop 2
SYMATTR InstName R17
SYMATTR Value {Rg}
SYMBOL res 4992 -1952 R90
WINDOW 0 0 56 VBottom 2
WINDOW 3 32 56 VTop 2
SYMATTR InstName R18
SYMATTR Value {Rg}
SYMBOL res 3664 -1408 R90
WINDOW 0 0 56 VBottom 2
WINDOW 3 32 56 VTop 2
SYMATTR InstName R19
SYMATTR Value {Rg}
SYMBOL pmos 4752 -1856 R180
SYMATTR InstName M1
SYMATTR Value RRR030P03
SYMBOL pmos 3824 -1856 M180
SYMATTR InstName M2
SYMATTR Value RRR030P03
SYMBOL nmos 3824 -1472 R0
SYMATTR InstName M3
SYMATTR Value RTR025N03
SYMBOL nmos 4752 -1472 M0
SYMATTR InstName M4
SYMATTR Value RTR025N03
SYMBOL voltage 448 -1152 R0
WINDOW 123 0 0 Left 0
WINDOW 39 0 0 Left 0
WINDOW 3 -559 53 Left 2
SYMATTR Value PULSE(0 20 {TC/2+50n} 1n 1n {TON} {TC} 1000)
SYMATTR InstName V_INH1
SYMBOL res 3904 -3888 R0
SYMATTR InstName R21
SYMATTR Value 4.7
SYMBOL cap 4192 -3712 R90
WINDOW 0 0 32 VBottom 2
WINDOW 3 32 32 VTop 2
SYMATTR InstName C1
SYMATTR Value 57p
SYMBOL cap 4224 -4096 R90
WINDOW 0 0 32 VBottom 2
WINDOW 3 32 32 VTop 2
SYMATTR InstName C2
SYMATTR Value 4.7n
SYMBOL res 4976 -3888 R0
SYMATTR InstName R22
SYMATTR Value 10
SYMBOL res 2784 -3888 R0
SYMATTR InstName R23
SYMATTR Value 10
SYMBOL res 1776 -3888 R0
SYMATTR InstName R24
SYMATTR Value 10
SYMBOL cap 3104 -4096 R90
WINDOW 0 0 32 VBottom 2
WINDOW 3 32 32 VTop 2
SYMATTR InstName C3
SYMATTR Value 1n
SYMBOL cap 2080 -4096 R90
WINDOW 0 0 32 VBottom 2
WINDOW 3 32 32 VTop 2
SYMATTR InstName C4
SYMATTR Value 2.7n
SYMBOL cap 5296 -4096 R90
WINDOW 0 0 32 VBottom 2
WINDOW 3 32 32 VTop 2
SYMATTR InstName C5
SYMATTR Value 1n
SYMBOL res 4288 -2896 R0
SYMATTR InstName R25
SYMATTR Value 12
SYMBOL voltage -528 -3408 R0
SYMATTR InstName V4
SYMATTR Value {V_HIGH}
SYMBOL voltage 448 -1472 R0
WINDOW 123 0 0 Left 0
WINDOW 39 0 0 Left 0
WINDOW 3 -559 53 Left 2
SYMATTR Value PULSE(3.3 0 {TC+TDELAY/4} 1n 1n {TON} {TC*2} 1000)
SYMATTR InstName V_WR1
SYMBOL npn 5664 -1968 R0
SYMATTR InstName Q20
SYMATTR Value 2N3904
SYMBOL npn 6064 -1968 R0
SYMATTR InstName Q21
SYMATTR Value 2N3904
SYMBOL pnp 5488 -1728 M180
SYMATTR InstName Q22
SYMATTR Value 2N3906
SYMBOL res 5536 -2128 R0
SYMATTR InstName R26
SYMATTR Value 520
SYMBOL res 5712 -1648 R0
SYMATTR InstName R27
SYMATTR Value 1k
SYMBOL res 6112 -1664 R0
SYMATTR InstName R28
SYMATTR Value 1k
SYMBOL res 3168 -1888 R0
SYMATTR InstName R_LOAD4
SYMATTR Value {R_INH}
SYMBOL diode 3168 -2000 R0
SYMATTR InstName D16
SYMATTR Value 1N914
SYMBOL diode 3168 -1472 R0
SYMATTR InstName D17
SYMATTR Value 1N914
SYMBOL diode 3088 -1472 R180
WINDOW 0 24 64 Left 2
WINDOW 3 24 0 Left 2
SYMATTR InstName D18
SYMATTR Value BZX84C27VLY
SYMBOL res 3008 -2160 R90
WINDOW 0 0 56 VBottom 2
WINDOW 3 32 56 VTop 2
SYMATTR InstName R29
SYMATTR Value {Rg}
SYMBOL pmos 3136 -2064 M180
SYMATTR InstName M6
SYMATTR Value RRR030P03
SYMBOL npn 1088 -1936 R0
SYMATTR InstName Q23
SYMATTR Value 2N3904
SYMBOL pnp 912 -1696 M180
SYMATTR InstName Q24
SYMATTR Value 2N3906
SYMBOL res 960 -2096 R0
SYMATTR InstName R30
SYMATTR Value 520
SYMBOL res 1136 -1616 R0
SYMATTR InstName R31
SYMATTR Value 1k
SYMBOL res 3168 -2560 R0
SYMATTR InstName R32
SYMATTR Value 0.01
SYMBOL diode -80 336 R0
SYMATTR InstName D19
SYMATTR Value 1N914
SYMBOL diode -80 560 R0
SYMATTR InstName D20
SYMATTR Value 1N914
SYMBOL pnp 2096 -80 M180
SYMATTR InstName Q25
SYMATTR Value 2DB1182Q
SYMBOL res 2144 416 R0
SYMATTR InstName R_LOAD6
SYMATTR Value 15
SYMBOL npn 1920 48 M0
SYMATTR InstName Q26
SYMATTR Value 2N3904
SYMBOL voltage 800 144 R0
SYMATTR InstName V5
SYMATTR Value 20
SYMBOL res 1840 432 R0
SYMATTR InstName R33
SYMATTR Value 1k
SYMBOL res 1456 -320 R0
SYMATTR InstName R34
SYMATTR Value 1k
SYMBOL res 1824 368 R90
WINDOW 0 0 56 VBottom 2
WINDOW 3 32 56 VTop 2
SYMATTR InstName R35
SYMATTR Value 1k
SYMBOL npn 1568 128 R0
SYMATTR InstName Q27
SYMATTR Value 2N3904
SYMBOL pnp 1536 432 R180
SYMATTR InstName Q28
SYMATTR Value 2DB1182Q
SYMBOL npn 1264 -304 R0
SYMATTR InstName Q29
SYMATTR Value 2N3904
SYMBOL diode 2144 336 R0
SYMATTR InstName D22
SYMATTR Value 1N914
SYMBOL diode 2144 560 R0
SYMATTR InstName D23
SYMATTR Value 1N914
SYMBOL diode 2144 -560 R0
SYMATTR InstName D13
SYMATTR Value 1N914
SYMBOL res 2144 -1040 R0
SYMATTR InstName R20
SYMATTR Value 15
TEXT -176 -4616 Left 2 !.lib ../../spice_models/tip42c.bjt
TEXT -176 -4648 Left 2 !.lib ../../spice_models/tip41c.bjt
TEXT 16 -2232 Left 2 !.step temp 0 50 25
TEXT 16 -2264 Left 2 ;.op
TEXT 16 -2200 Left 2 !;.step param V_HIGH 18 25 1
TEXT -176 -4432 Left 2 !.param beta=3468
TEXT -176 -4464 Left 2 !;.step param beta 3100 4000 100
TEXT -176 -4400 Left 2 ;{300*exp(beta*(1/(TEMP+273.15)-1/(25+273.15)))}
TEXT 616 -4480 Left 2 !.param L_FERRITE=1p
TEXT 616 -4512 Left 2 !.param R_X=25 R_Y=19 R_INH=15
TEXT 1888 -4424 Left 2 !.param R_ISENSE_INH=0.365
TEXT 536 -2296 Left 2 !;.step param R_TRIM 4.1k 4.2k 20
TEXT 544 -2256 Left 2 !.param R_TRIM=3.95k
TEXT 16 -2168 Left 2 !.param V_HIGH 20
TEXT 16 -2136 Left 2 !;.param temp 25
TEXT 592 -4568 Left 2 !.model LDSW SW(Ron=1m Roff=1Meg Vt=.5 Vh=-.4)
TEXT 16 -2296 Left 2 ;.tran 10u
TEXT 3856 -4352 Left 2 !.param R_ISENSE_XY=0.34
TEXT 16 -2008 Left 2 !.tran {TC*10} uic
TEXT 16 -2072 Left 2 !.param TON=200n
TEXT 16 -2040 Left 2 !.param TC=500n
TEXT 3600 -2072 Left 2 !.param Rg=1m
TEXT 3520 -2024 Left 2 !;.step param Rg 10 100 10
TEXT 16 -2104 Left 2 ;.dc V_RD 0 3.3 0.01
TEXT 3600 -2104 Left 2 !.param Rout=33
TEXT -64 -1616 Left 2 ;PULSE(3.3 0 {TDELAY/4} 1n 1n {TON} {TC})
TEXT -176 -4584 Left 2 !.lib ../../spice_models/ssm6l40tu_n.lib
TEXT -176 -4552 Left 2 !.lib ../../spice_models/ssm6l40tu_p.lib
TEXT 4240 -984 Left 2 ;See https://fscdn.rohm.com/en/products/databook/applinote/common/how_to_use_ltspice_models_an-e.pdf\non how to use .subck models in FETs and other primitives.
TEXT 848 -1240 Left 2 ;See https://fscdn.rohm.com/en/products/databook/applinote/common/how_to_use_ltspice_models_an-e.pdf\non how to use .subck models in FETs and other primitives.
TEXT 16 -1976 Left 2 !.param TDELAY = {TC-TON}
TEXT -176 -4520 Left 2 !.lib ../../spice_models/2db1182q.bjt
TEXT -216 -1360 Left 2 ;PULSE(3.3 0 {TC/2+TDELAY/4} 1n 1n {TON} {TC} 1000)
TEXT 5040 -688 Left 2 ;The low-side FET needs shorter on-time than the top-side to avoid swtich\ncurrents flowing through the load. Turn-on needs to be delayed by about 50ns,\nturn-off brought in by about the same amount.
CIRCLE Normal 384 -4048 208 -4160 2

The netlist it stands for:
* current_switch_test_bed_2.asc
Q2 N044 N042 N041 0 2DB1182Q
R_LOAD5 N049 N051 15
D5 0 N036 TDZV20
I5 0 N036 0.37
Q3 N038 N044 N046 0 2N3904
V7 N038 0 20
R12 N046 0 1k
R13 N038 N042 1k
R14 N046 N045 1k
V8 N040 0 PULSE(0 20 00n 1n 1n 198n 500n)
Q5 N038 N040 N045 0 2N3904
Q4 0 N045 N042 0 2DB1182Q
Q6 N038 N040 N042 0 2N3904
V1 N036 N041 2
R1 DB N024 {R_TRIM}
R2 N002 v_3 {R_ISENSE_INH}
Q1 v_4 N003 v_3 0 2DB1182Q
Q7 0 DB N016 0 2N3906
Q8 DB DB N015 0 2N3906
R3 N001 VT 145
R4 VT N014 145
RT1 N001 VT {300*exp(beta*(1/(TEMP+273.15)-1/(25+273.15)))}
D1 v_4 N003 BAT54SHY
D2 N023 N001 BZX84C6V2L
R5 N025 0 4.7k
Q9 0 N025 N024 0 2N3906
Q10 N025 N025 N023 0 2N3906
R6 N002 N005 {R_ISENSE_INH}
Q11 N010 N004 N005 0 2DB1182Q
Q12 0 N017 N019 0 2N3906
D3 N010 N004 BAT54SHY
Q13 N001 N016 N017 0 2N3904
Q14 0 N017 N018 0 2N3906
R7 N017 0 1k
Q15 N015 N015 N014 0 2DB1182Q
R8 N016 N001 200
R9 N002 N007 {R_ISENSE_XY}
Q16 N011 N006 N007 0 2DB1182Q
Q17 0 N017 N020 0 2N3906
D4 N011 N006 BAT54SHY
R_LOAD1 LEFT RIGHT {R_X}
R10 N002 N009 {R_ISENSE_XY}
Q18 N012 N008 N009 0 2DB1182Q
Q19 0 N017 N021 0 2N3906
D6 N012 N008 BAT54SHY
S1 N022 N012 N013 0 LDSW
V2 N013 0 PULSE(1 0 350n 1n 1n 150n 500n 10)
R_LOAD2 N022 0 {R_Y}
R11 V_HIGH N002 0.1m
R15 V_HIGH N001 0.1m
V3 V_HIGH 0 {V_HIGH}
D7 N032 LEFT 1N914
D8 LEFT N035 1N914
D9 N033 RIGHT 1N914
D10 RIGHT Dbr 1N914
D11 0 RIGHT BZX84C27VLY
D12 0 LEFT BZX84C27VLY
V_RD1 _RD 0 PULSE(3.3 0 {TDELAY/4} 1n 1n {TON} {TC*2})
V_EN1 EN 0 3.3
V_LOGIC1 V_LOGIC 0 3.3
R16 Gtl TL {Rg}
R17 BR Gbr {Rg}
R18 TR Gtr {Rg}
R19 Gbl BL {Rg}
M1 N033 Gtr CS0 CS0 RRR030P03
M2 N032 Gtl CS0 CS0 RRR030P03
M3 N035 Gbl 0 0 RTR025N03
M4 Dbr Gbr 0 0 RTR025N03
V_INH1 INH 0 PULSE(0 20 {TC/2+50n} 1n 1n {TON} {TC} 1000)
R21 N006 N020 4.7
C1 N011 N006 57p
C2 N007 N006 4.7n
R22 N008 N021 10
R23 N004 N019 10
R24 N003 N018 10
C3 N005 N004 1n
C4 v_3 N003 2.7n
C5 N009 N008 1n
R25 N011 CS0 12
V4 V_HIGH2 0 {V_HIGH}
V_WR1 _WR 0 PULSE(3.3 0 {TC+TDELAY/4} 1n 1n {TON} {TC*2} 1000)
Q20 V_HIGH N028 V_TOP_DRV 0 2N3904
Q21 V_HIGH N028 V_TOP_DRV2 0 2N3904
Q22 0 CS0 N028 0 2N3906
R26 V_HIGH N028 520
R27 V_TOP_DRV 0 1k
R28 V_TOP_DRV2 0 1k
R_LOAD4 N030 N034 {R_INH}
D16 N029 N030 1N914
D17 N034 0 1N914
D18 0 N030 BZX84C27VLY
R29 N027 INH_DRV3 {Rg}
M6 N029 N027 N026 N026 RRR030P03
Q23 V_HIGH N031 V_INH_DRV 0 2N3904
Q24 0 N026 N031 0 2N3906
R30 V_HIGH N031 520
R31 V_INH_DRV 0 1k
R32 N010 N026 0.01
D19 N044 N049 1N914
D20 N051 0 1N914
Q25 V_2 N043 V_1 0 2DB1182Q
R_LOAD6 N050 N052 15
Q26 N039 V_2 N048 0 2N3904
V5 N039 0 20
R33 N048 0 1k
R34 N039 N043 1k
R35 N048 N047 1k
Q27 N039 INH N047 0 2N3904
Q28 0 N047 N043 0 2DB1182Q
Q29 N039 INH N043 0 2N3904
D22 V_2 N050 1N914
D23 N052 0 1N914
D13 N037 V_1 1N914
R20 v_4 N037 15
.model D D
.lib standard.dio
.model NPN NPN
.model PNP PNP
.lib standard.bjt
.model NMOS NMOS
.model PMOS PMOS
.lib standard.mos
.lib ../../spice_models/tip42c.bjt
.lib ../../spice_models/tip41c.bjt
.step temp 0 50 25
* .op
;.step param V_HIGH 18 25 1
.param beta=3468
;.step param beta 3100 4000 100
* {300*exp(beta*(1/(TEMP+273.15)-1/(25+273.15)))}
.param L_FERRITE=1p
.param R_X=25 R_Y=19 R_INH=15
.param R_ISENSE_INH=0.365
;.step param R_TRIM 4.1k 4.2k 20
.param R_TRIM=3.95k
.param V_HIGH 20
;.param temp 25
.model LDSW SW(Ron=1m Roff=1Meg Vt=.5 Vh=-.4)
* .tran 10u
.param R_ISENSE_XY=0.34
.tran {TC*10} uic
.param TON=200n
.param TC=500n
.param Rg=1m
;.step param Rg 10 100 10
* .dc V_RD 0 3.3 0.01
.param Rout=33
* PULSE(3.3 0 {TDELAY/4} 1n 1n {TON} {TC})
.lib ../../spice_models/ssm6l40tu_n.lib
.lib ../../spice_models/ssm6l40tu_p.lib
* See https://fscdn.rohm.com/en/products/databook/applinote/common/how_to_use_ltspice_models_an-e.pdf
* on how to use .subck models in FETs and other primitives.
* See https://fscdn.rohm.com/en/products/databook/applinote/common/how_to_use_ltspice_models_an-e.pdf
* on how to use .subck models in FETs and other primitives.
.param TDELAY = {TC-TON}
.lib ../../spice_models/2db1182q.bjt
* PULSE(3.3 0 {TC/2+TDELAY/4} 1n 1n {TON} {TC} 1000)
* The low-side FET needs shorter on-time than the top-side to avoid swtich
* currents flowing through the load. Turn-on needs to be delayed by about 50ns,
* turn-off brought in by about the same amount.
.backanno
.end